# EAGLE design Diversity1.0 (EAGLE 5.11)
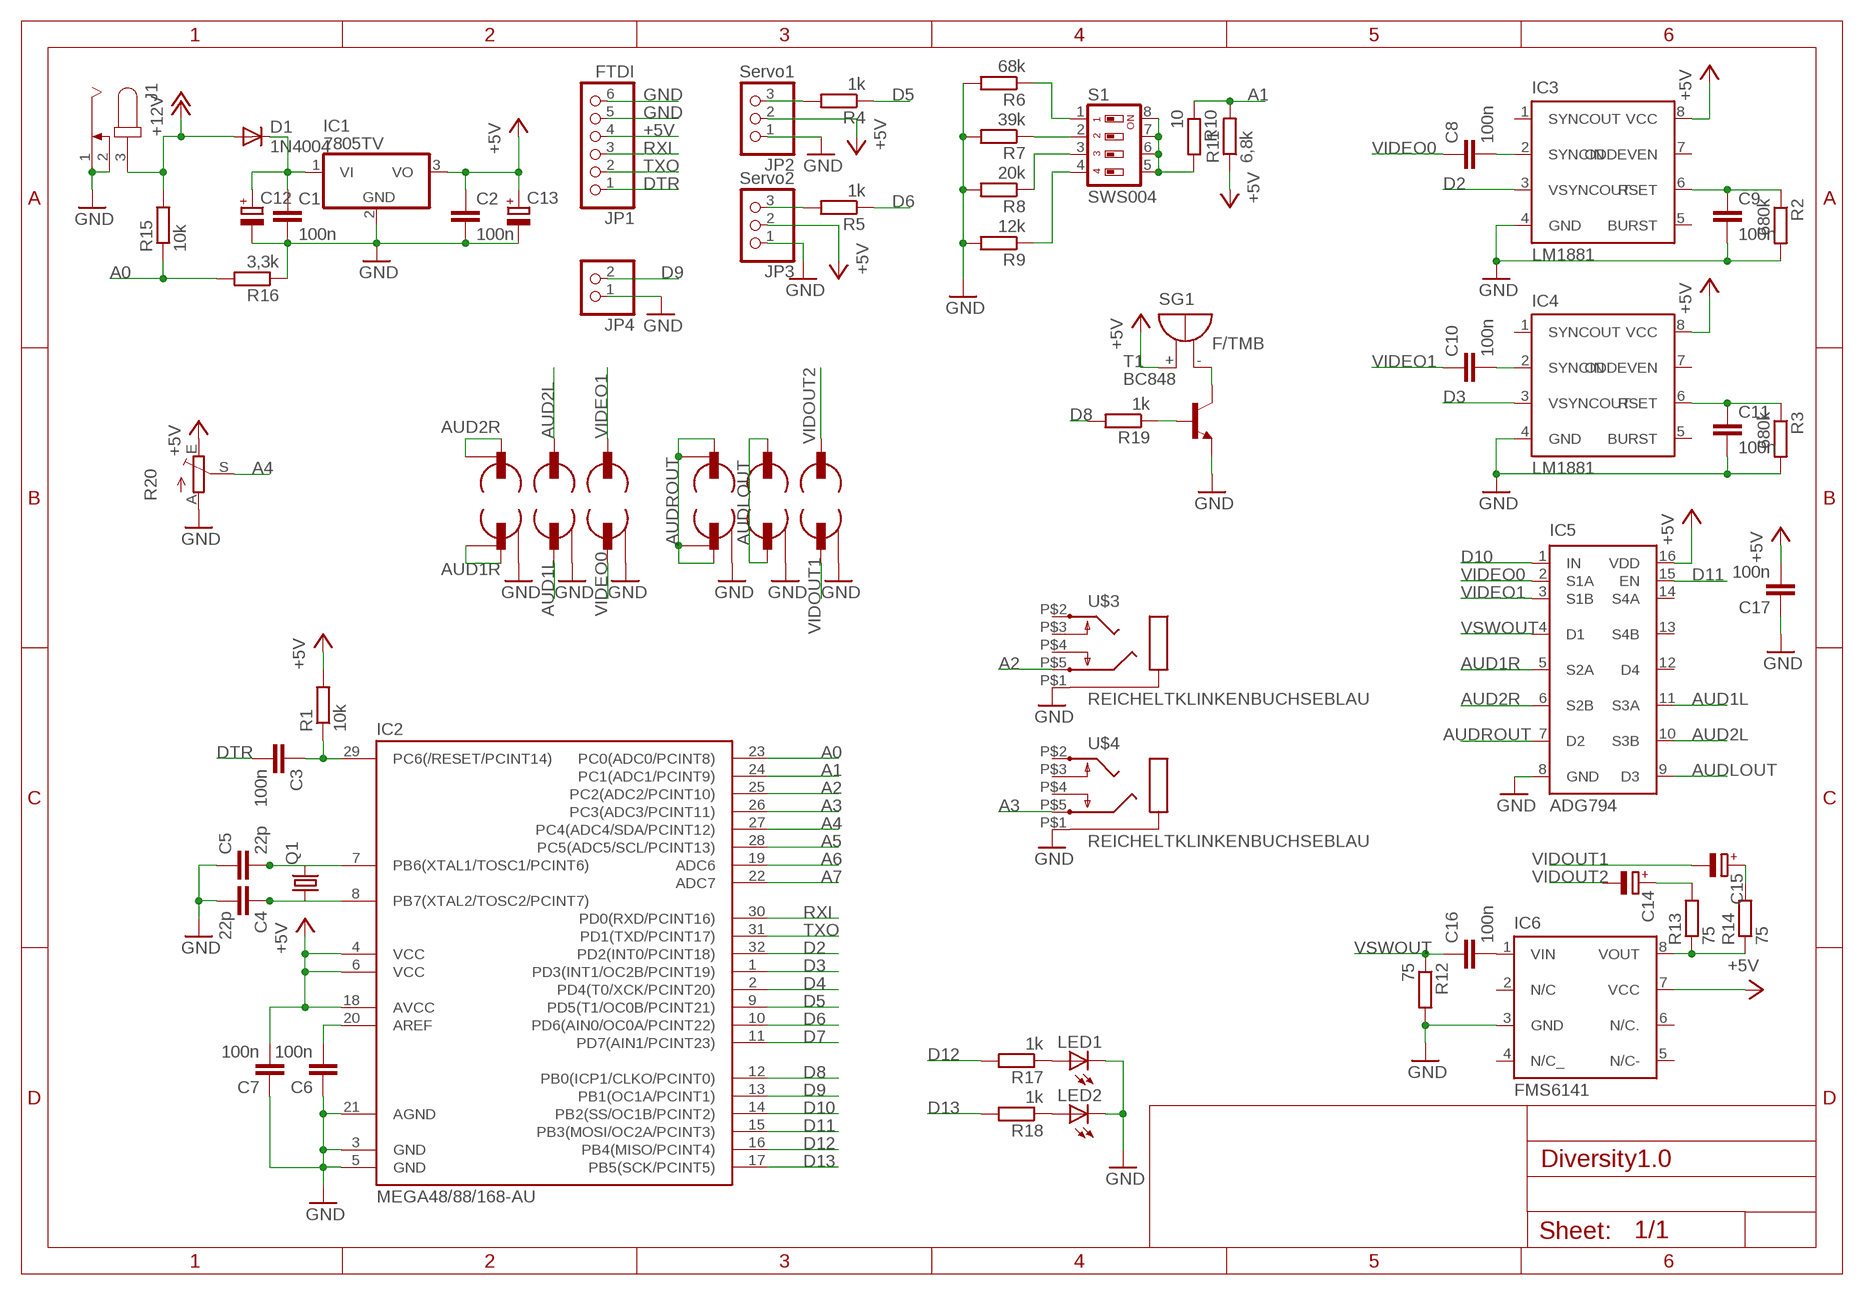
[diagram p0: schematic, sheet 1]

## Parts
C1  100n  C-EUC0805  [C0805]
C2  100n  C-EUC0805  [C0805]
C3  100n  C-EUC0805  [C0805]
C4  22p  C-EUC0805  [C0805]
C5  22p  C-EUC0805  [C0805]
C6  100n  C-EUC0805  [C0805]
C7  100n  C-EUC0805  [C0805]
C8  100n  C-EUC0805  [C0805]
C9  100n  C-EUC0805  [C0805]
C10  100n  C-EUC0805  [C0805]
C11  100n  C-EUC0805  [C0805]
C12  CPOL-EUE3.5-8  [E3,5-8]
C13  CPOL-EUE2.5-5  [E2,5-5]
C14  CPOL-EUE2.5-6  [E2,5-6]
C15  CPOL-EUE2.5-6  [E2,5-6]
C16  100n  C-EUC0805  [C0805]
C17  100n  C-EUC0805  [C0805]
D1  1N4004  [DO41-10]
IC1  7805TV  [TO220V]
IC2  MEGA48/88/168-AU  [TQFP32-08]
IC3  LM1881  [DIL08]
IC4  LM1881  [DIL08]
IC5  ADG794  [QSOP16]
IC6  FMS6141  [SO8]
J1  JACK-PLUG0  [SPC4077]
JP1  FTDI  PINHD-1X6  [1X06]
JP2  Servo1  PINHD-1X3  [1X03]
JP3  Servo2  PINHD-1X3  [1X03]
JP4  PINHD-1X2  [1X02]
LED1  LEDCHIP-LED0805  [CHIP-LED0805]
LED2  LEDCHIP-LED0805  [CHIP-LED0805]
Q1  CRYSTALSM49  [SM49]
R1  10k  R-EU_R0805  [R0805]
R2  680k  R-EU_R0805  [R0805]
R3  680k  R-EU_R0805  [R0805]
R4  1k  R-EU_R0805  [R0805]
R5  1k  R-EU_R0805  [R0805]
R6  68k  R-EU_R0805  [R0805]
R7  39k  R-EU_R0805  [R0805]
R8  20k  R-EU_R0805  [R0805]
R9  12k  R-EU_R0805  [R0805]
R10  10  R-EU_R0805  [R0805]
R11  6,8k  R-EU_R0805  [R0805]
R12  75  R-EU_R0805  [R0805]
R13  75  R-EU_R0805  [R0805]
R14  75  R-EU_R0805  [R0805]
R15  10k  R-EU_R0805  [R0805]
R16  3,3k  R-EU_R0805  [R0805]
R17  1k  R-EU_R0805  [R0805]
R18  1k  R-EU_R0805  [R0805]
R19  1k  R-EU_R0805  [R0805]
R20  TRIM_EU-PT10  [PT-10]
S1  SWS004  [SMS-004]
SG1  F/TMB  [F/TMB]
T1  BC848  [SOT23]
U$3  REICHELTKLINKENBUCHSEBLAU  [PG203J]
U$4  REICHELTKLINKENBUCHSEBLAU  [PG203J]
U$5  POLLINCINCHBUCHSE  [POLLIN6FACHCINCH]
U$6  POLLINCINCHBUCHSE  [POLLIN6FACHCINCH]

## Nets
+5V: C2.1 C7.2 C13.+ C17.2 IC1.3(VO) IC2.4(VCC) IC2.6(VCC) IC2.18(AVCC) IC3.8(VCC) IC4.8(VCC) IC5.16(VDD) IC6.7(VCC) JP1.4 JP2.2 JP3.2 R1.2 R11.1 R20.E SG1.+
+12V: D1.A J1.3 R15.2
A0: IC2.23(PC0(ADC0/PCINT8)) R15.1 R16.2
A1: IC2.24(PC1(ADC1/PCINT9)) R10.1 R11.2
A2: IC2.25(PC2(ADC2/PCINT10)) U$3.P$5
A3: IC2.26(PC3(ADC3/PCINT11)) U$4.P$5
A4: IC2.27(PC4(ADC4/SDA/PCINT12)) R20.S
A5: IC2.28(PC5(ADC5/SCL/PCINT13))
A6: IC2.19(ADC6)
A7: IC2.22(ADC7)
AUD1L: IC5.11(S3A) U$6.AUDIOLUNTEN(AUDLUNTEN)
AUD1R: IC5.5(S2A) U$6.AUDIORUNTEN1(AUDRUNTEN1) U$6.AUDIORUNTEN2(AUDRUNTEN2)
AUD2L: IC5.10(S3B) U$6.AUDIOLOBEN(AUDLOBEN)
AUD2R: IC5.6(S2B) U$6.AUDIOROBEN1(AUDROBEN1) U$6.AUDIOROBEN2(AUDROBEN2)
AUDLOUT: IC5.9(D3) U$5.AUDIOLOBEN(AUDLOBEN) U$5.AUDIOLUNTEN(AUDLUNTEN)
AUDROUT: IC5.7(D2) U$5.AUDIOROBEN1(AUDROBEN1) U$5.AUDIOROBEN2(AUDROBEN2) U$5.AUDIORUNTEN1(AUDRUNTEN1) U$5.AUDIORUNTEN2(AUDRUNTEN2)
D2: IC2.32(PD2(INT0/PCINT18)) IC3.3(VSYNCOUT)
D3: IC2.1(PD3(INT1/OC2B/PCINT19)) IC4.3(VSYNCOUT)
D4: IC2.2(PD4(T0/XCK/PCINT20))
D5: IC2.9(PD5(T1/OC0B/PCINT21)) R4.1
D6: IC2.10(PD6(AIN0/OC0A/PCINT22)) R5.1
D7: IC2.11(PD7(AIN1/PCINT23))
D8: IC2.12(PB0(ICP1/CLKO/PCINT0)) R19.2
D9: IC2.13(PB1(OC1A/PCINT1)) JP4.2
D10: IC2.14(PB2(SS/OC1B/PCINT2)) IC5.1(IN)
D11: IC2.15(PB3(MOSI/OC2A/PCINT3)) IC5.15(EN)
D12: IC2.16(PB4(MISO/PCINT4)) R17.2
D13: IC2.17(PB5(SCK/PCINT5)) R18.2
DTR: C3.2 JP1.1
GND: C1.2 C2.2 C4.2 C5.1 C6.1 C7.1 C9.2 C11.2 C12.- C13.- C17.1 IC1.2(GND) IC2.3(GND) IC2.5(GND) IC2.21(AGND) IC3.4(GND) IC4.4(GND) IC5.8(GND) IC6.3(GND) J1.1 J1.2 JP1.5 JP1.6 JP2.1 JP3.1 JP4.1 LED1.C LED2.C R2.2 R3.2 R6.2 R7.2 R8.2 R9.2 R12.2 R16.1 R20.A T1.2(E) U$3.P$1 U$4.P$1 U$5.GND1(G1) U$5.GND2(G2) U$5.GND3(G3) U$6.GND1(G1) U$6.GND2(G2) U$6.GND3(G3)
N$1: C5.2 IC2.7(PB6(XTAL1/TOSC1/PCINT6)) Q1.2
N$2: C4.1 IC2.8(PB7(XTAL2/TOSC2/PCINT7)) Q1.1
N$3: C3.1 IC2.29(PC6(/RESET/PCINT14)) R1.1
N$4: C6.2 IC2.20(AREF)
N$5: C16.2 IC6.1(VIN)
N$6: LED1.A R17.1
N$7: LED2.A R18.1
N$8: C1.1 C12.+ D1.C IC1.1(VI)
N$9: R6.1 S1.1
N$10: C15.+ R14.2
N$11: C14.+ R13.2
N$12: R7.1 S1.2
N$13: R8.1 S1.3
N$14: SG1.- T1.3(C)
N$15: R19.1 T1.1(B)
N$16: R9.1 S1.4
N$27: C8.2 IC3.2(SYNCIN)
N$28: C9.1 IC3.6(RSET) R2.1
N$29: JP2.3 R4.2
N$30: C10.2 IC4.2(SYNCIN)
N$31: C11.1 IC4.6(RSET) R3.1
N$32: JP3.3 R5.2
N$37: IC6.8(VOUT) R13.1 R14.1
N$39: R10.2 S1.5 S1.6 S1.7 S1.8
RXI: IC2.30(PD0(RXD/PCINT16)) JP1.3
TXO: IC2.31(PD1(TXD/PCINT17)) JP1.2
VIDEO0: C8.1 IC5.2(S1A) U$6.VIDEOUNTEN
VIDEO1: C10.1 IC5.3(S1B) U$6.VIDEOOBEN
VIDOUT1: C15.- U$5.VIDEOUNTEN
VIDOUT2: C14.- U$5.VIDEOOBEN
VSWOUT: C16.1 IC5.4(D1) R12.1
Unconnected: IC3.1(SYNCOUT) IC3.5(BURST) IC3.7(ODDEVEN) IC4.1(SYNCOUT) IC4.5(BURST) IC4.7(ODDEVEN) IC5.12(D4) IC5.13(S4B) IC5.14(S4A) IC6.2(N/C) IC6.5(N/C-) IC6.6(N/C.) U$3.P$2 U$3.P$3 U$3.P$4 U$4.P$2 U$4.P$3 U$4.P$4

## Power pins joined to a net without a drawn wire
N/C_: IC6.4(N/C_)

## Library data of the parts
C1-C11 C16 C17 = rcl:C-EU: CAPACITOR, European symbol
C12-C15 = rcl:CPOL-EU: POLARIZED CAPACITOR, European symbol
D1 = diode:1N4004: DIODE general purpose rectifier, 1 A
IC1 = linear:78*: Positive VOLTAGE REGULATOR Source: http://cache.national.com/ds/LM/LM78L05.pdf http://www.fairchildsemi.com/ds/LM/LM7805.pdf
IC2 = avr-4:MEGA48/88/168
IC3 IC4 = lm1881:LM1881
IC5 = 001eigene:ADG794
IC6 = 001eigene:FMS6141
J1 = con-jack:JACK-PLUG: DC POWER JACK Power Jack, DC, Right Angle, Through Hole, Rated 5A at 16VDC, PC Terminals Distributor: Farnell (www.Farnell.de) Drawing: 84N1161.pdf / 84N1162.pdf Manufacturer: SPC Technology (www.spctechnology.com) Type: SPC4077 / SPC 4078; OC_FARNELL: unknown; OC_NEWARK: unknown
JP1 = pinhead:PINHD-1X6: PIN HEADER
JP2 JP3 = pinhead:PINHD-1X3: PIN HEADER
JP4 = pinhead:PINHD-1X2: PIN HEADER
LED1 LED2 = led:LED: LED OSRAM: - CHIPLED LG R971, LG N971, LY N971, LG Q971, LY Q971, LO R971, LY R971 LH N974, LH R974 LS Q976, LO Q976, LY Q976 LO Q996 - Hyper CHIPLED LW Q18S LB Q993, LB Q99A, LB R99A - SideLED LS A670, LO A670, LY A670, LG A670, LP A670 LB A673, LV A673, LT A673, LW A673 LH A674 LY A675 LS A676, LA A676, LO A676, LY A676, LW A676 LS A679, LY A679, LG A679 - Hyper Micro SIDELED® LS Y876, LA Y876, LO Y876, LY Y876 LT Y87S - SmartLED LW L88C, LW L88S LB L89C, LB L89S, LG L890 LS L89K, LO L89K, LY L89K LS L896, LA L896, LO L896, LY L896 - TOPLED LS T670, LO T670, LY T670, LG T670, LP T670 LSG T670, LSP T670, LSY T670, LOP T670, LYG T670 LG T671, LOG T671, LSG T671 LB T673, LV T673, LT T673, LW T673 LH T674 LS T676, LA T676, LO T676, LY T676, LB T676, LH T676, LSB T676, LW T676 LB T67C, LV T67C, LT T67C, LS T67K, LO T67K, LY T67K, LW E67C LS E67B, LA E67B, LO E67B, LY E67B, LB E67C, LV E67C, LT E67C LW T67C LS T679, LY T679, LG T679 LS T770, LO T770, LY T770, LG T770, LP T770 LB T773, LV T773, LT T773, LW T773 LH T774 LS E675, LA E675, LY E675, LS T675 LS T776, LA T776, LO T776, LY T776, LB T776 LHGB T686 LT T68C, LB T68C - Hyper Mini TOPLED® LB M676 - Mini TOPLED Santana® LG M470 LS M47K, LO M47K, LY M47K Source: http://www.osram.convergy.de LUXEON: - LUMILED® LXK2-PW12-R00, LXK2-PW12-S00, LXK2-PW14-U00, LXK2-PW14-V00 LXK2-PM12-R00, LXK2-PM12-S00, LXK2-PM14-U00 LXK2-PE12-Q00, LXK2-PE12-R00, LXK2-PE12-S00, LXK2-PE14-T00, LXK2-PE14-U00 LXK2-PB12-K00, LXK2-PB12-L00, LXK2-PB12-M00, LXK2-PB14-N00, LXK2-PB14-P00, LXK2-PB14-Q00 LXK2-PR12-L00, LXK2-PR12-M00, LXK2-PR14-Q00, LXK2-PR14-R00 LXK2-PD12-Q00, LXK2-PD12-R00, LXK2-PD12-S00 LXK2-PH12-R00, LXK2-PH12-S00 LXK2-PL12-P00, LXK2-PL12-Q00, LXK2-PL12-R00 Source: www.luxeon.com KINGBRIGHT: KA-3528ASYC Source: www.kingbright.com
Q1 = crystal:CRYSTAL: CRYSTAL; OC_FARNELL: unknown; OC_NEWARK: unknown
R1-R19 = rcl:R-EU_: RESISTOR, European symbol
R20 = pot:TRIM_EU-: POTENTIOMETER
S1 = smd-special:SWS004: SMD Dip Switch 4 pol.
SG1 = buzzer:F/TMB: BUZZER Source: Buerklin; OC_FARNELL: unknown; OC_NEWARK: unknown
T1 = transistor:BC848: NPN TRANSISTOR
U$3 U$4 = 001klinke:REICHELTKLINKENBUCHSEBLAU
U$5 U$6 = pollin:POLLINCINCHBUCHSE

## Board
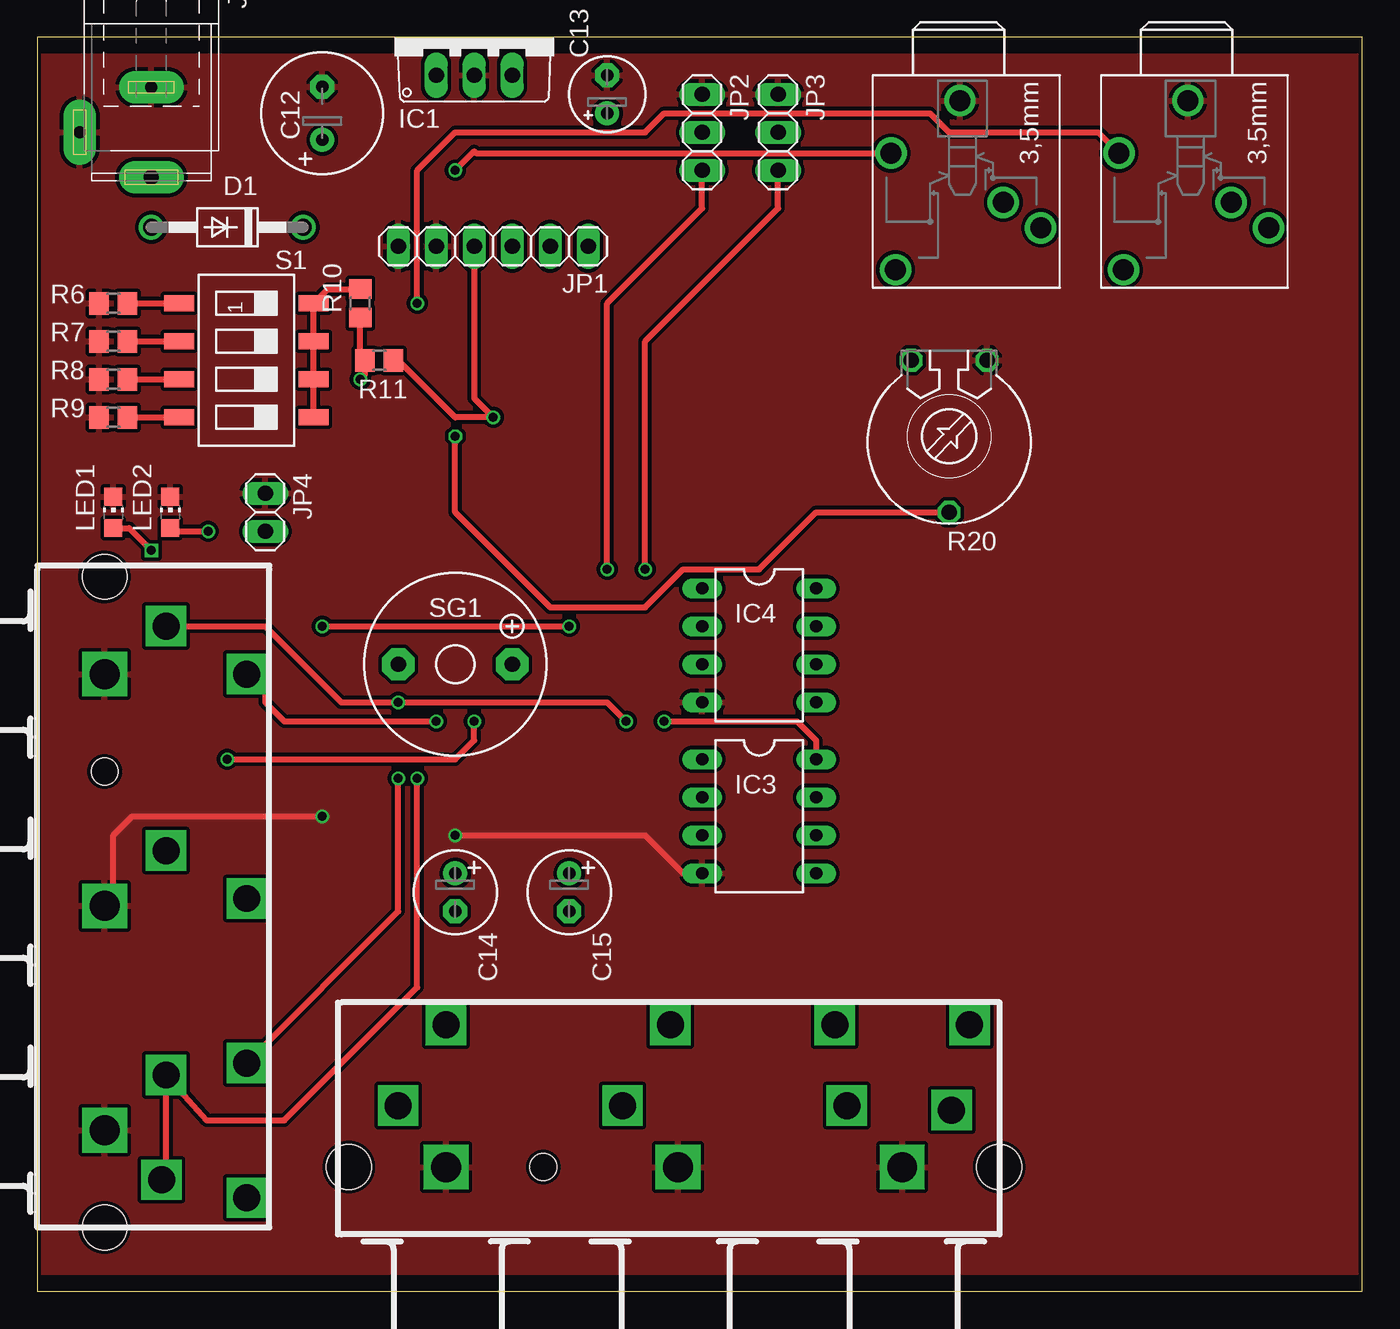
[diagram p1: board, top side]
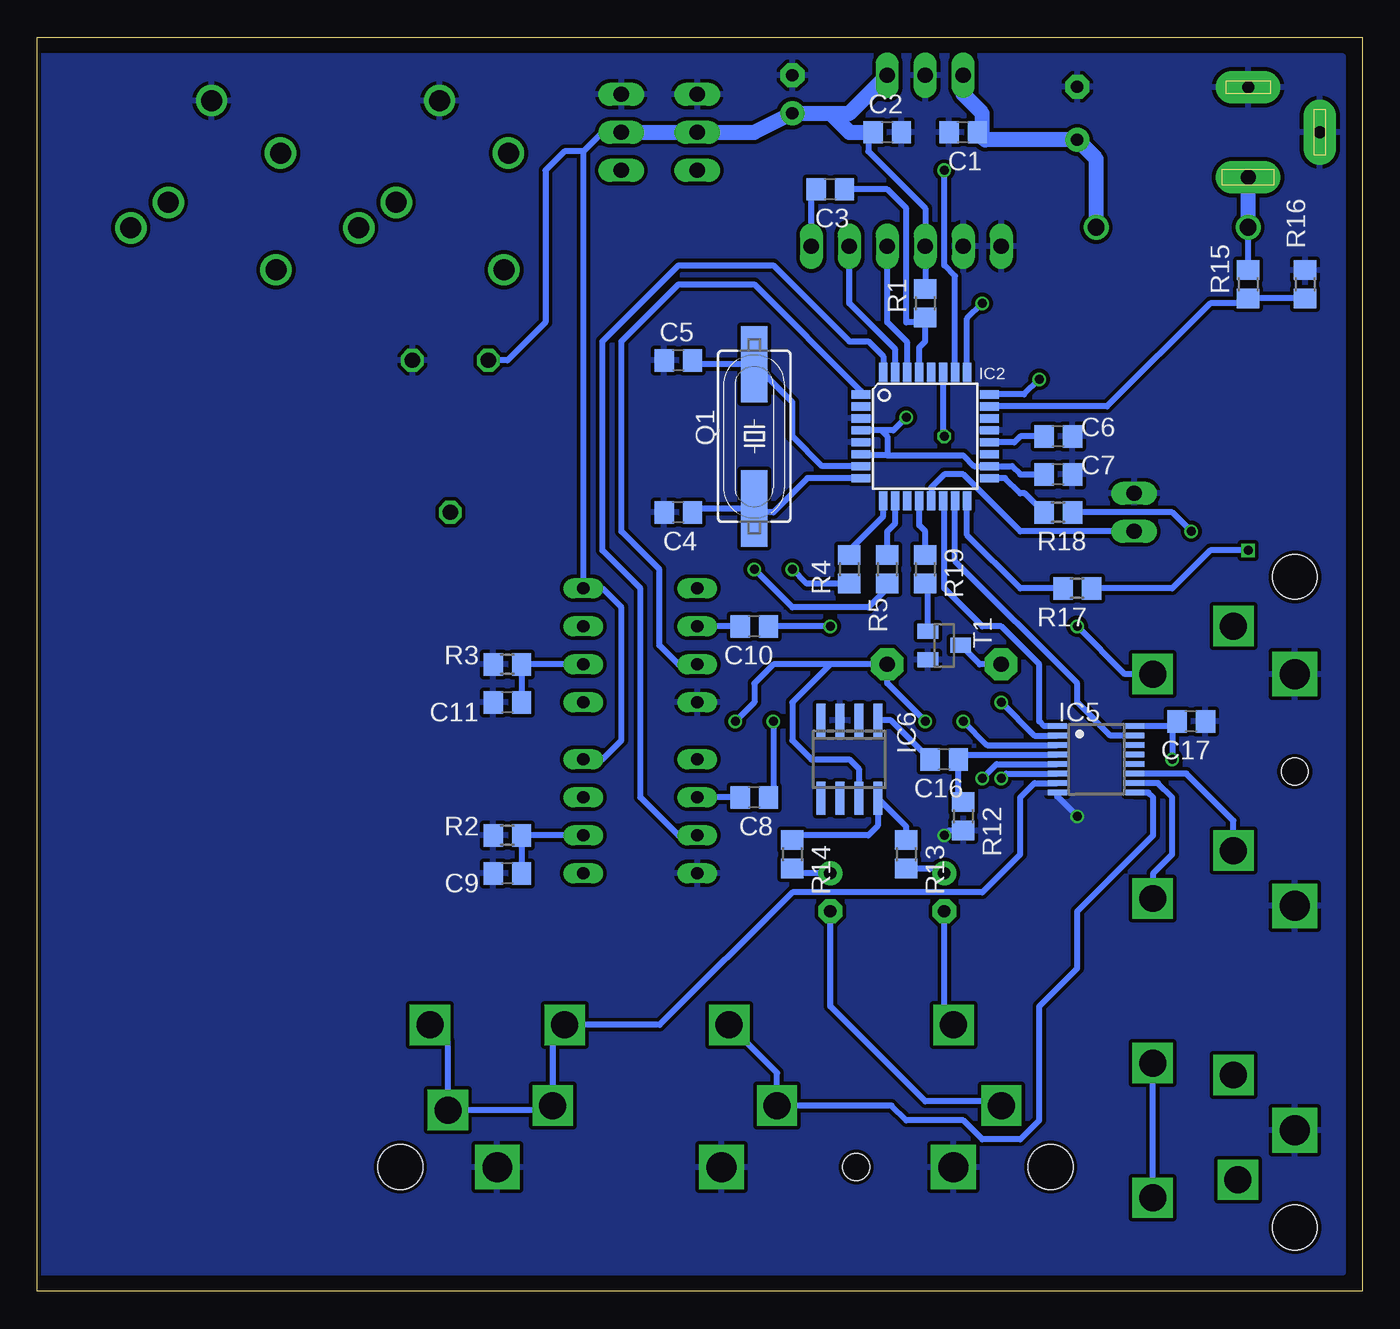
[diagram p2: board, bottom side, seen from below]

Size 88.57 x 83.81 mm. Coordinates in mm from the lower left corner, seen from the top.
Outline: 0,0 88.57,0 88.57,83.81 0,83.81 0,0
Copper layers (1*16): Top 0.035mm / dielectric 1.5mm / Bottom 0.035mm
Design rules "ITead_rule": minimum track width 6mil, minimum drill 12mil, track to track 6mil, track to pad 6mil, pad to pad 6mil, via to via 6mil, smd to smd 0mil, copper to edge 10mil, drill to drill 10mil, minimum pad ring 10mil, minimum via ring 6mil, stop-mask expansion 2mil, vias tented up to drill 100mil, thermal gap 10mil

### Footprints (pad centres in the part's own frame; a part is rotated, then mirrored left to right if it is on the bottom)
C0805 = smd 1.3 x 1.5: 1 -0.95,0; 2 0.95,0
E3,5-8 = drill 0.813 pad 1.6 round: + -1.778,0 | drill 0.813 pad 1.6 octagon: - 1.778,0
E2,5-5 = drill 0.813 pad 1.6 round: + -1.27,0 | drill 0.813 pad 1.6 octagon: - 1.27,0
E2,5-6 = drill 0.813 pad 1.6 round: + -1.27,0 | drill 0.813 pad 1.6 octagon: - 1.27,0
DO41-10 = drill 1.118 round: A 5.08,0; C -5.08,0
TO220V = drill 1.016 long: 1 -2.54,-2.54; 2 0,-2.54; 3 2.54,-2.54
TQFP32-08 = smd 1.27 x 0.559: 1 -4.293,2.8; 2 -4.293,2; 3 -4.293,1.2; 4 -4.293,0.4; 5 -4.293,-0.4; 6 -4.293,-1.2; 7 -4.293,-2; 8 -4.293,-2.8; 17 4.293,-2.8; 18 4.293,-2; 19 4.293,-1.2; 20 4.293,-0.4; 21 4.293,0.4; 22 4.293,1.2; 23 4.293,2; 24 4.293,2.8 | smd 0.559 x 1.27: 9 -2.8,-4.293; 10 -2,-4.293; 11 -1.2,-4.293; 12 -0.4,-4.293; 13 0.4,-4.293; 14 1.2,-4.293; 15 2,-4.293; 16 2.8,-4.293; 25 2.8,4.293; 26 2,4.293; 27 1.2,4.293; 28 0.4,4.293; 29 -0.4,4.293; 30 -1.2,4.293; 31 -2,4.293; 32 -2.8,4.293
DIL08 = drill 0.813 long: 1 -3.81,-3.81; 2 -1.27,-3.81; 3 1.27,-3.81; 4 3.81,-3.81; 5 3.81,3.81; 6 1.27,3.81; 7 -1.27,3.81; 8 -3.81,3.81
QSOP16 = smd 0.381 x 1.27: 1 0.318,-0.06; 2 0.953,-0.06; 3 1.587,-0.06; 4 2.223,-0.06; 5 2.857,-0.06; 6 3.493,-0.06; 7 4.128,-0.06; 8 4.763,-0.06; 9 4.763,5.14; 10 4.128,5.14; 11 3.493,5.14; 12 2.857,5.14; 13 2.223,5.14; 14 1.587,5.14; 15 0.953,5.14; 16 0.318,5.14
SO8 = smd 0.6 x 2.2: 1 0.635,-0.06; 2 1.905,-0.06; 3 3.175,-0.06; 4 4.445,-0.06; 5 4.445,5.14; 6 3.175,5.14; 7 1.905,5.14; 8 0.635,5.14
SPC4077 = drill 0.8 pad 2.184 long: 1 -3,0; 2 0,-4.8 | drill 1 pad 2.184 long: 3 3,0
1X06 = drill 1.016 long: 1 -6.35,0; 2 -3.81,0; 3 -1.27,0; 4 1.27,0; 5 3.81,0; 6 6.35,0
1X03 = drill 1.016 long: 1 -2.54,0; 2 0,0; 3 2.54,0
1X02 = drill 1.016 long: 1 -1.27,0; 2 1.27,0
CHIP-LED0805 = smd 1.2 x 1.2: A 0,-1.05; C 0,1.05
SM49 = smd 5.08 x 1.778: 1 -4.826,0; 2 4.826,0
R0805 = smd 1.3 x 1.5: 1 -0.95,0; 2 0.95,0
PT-10 = drill 1.016 octagon: A -2.54,-5.08; E 2.54,-5.08; S 0,5.08
SMS-004 = smd 1.092 x 2.007: 1 -3.81,-4.496; 2 -1.27,-4.496; 3 1.27,-4.496; 4 3.81,-4.496; 5 3.81,4.496; 6 1.27,4.496; 7 -1.27,4.496; 8 -3.81,4.496
F/TMB = drill 1.016 pad 2.159 octagon: + 3.81,0; - -3.81,0
SOT23 = smd 1 x 1.4: 1 -0.95,-1.1; 2 0.95,-1.1; 3 0,1.1
PG203J = drill 1.4 round: P$1 1.7,5.8; P$2 10.2,11.2; P$3 8.5,8.7; P$4 13,1.5; P$5 5.2,1.2
POLLIN6FACHCINCH = drill 1.8 square: AUDIOLOBEN -14,22; AUDIOLUNTEN -8.6,18.8; AUDIOROBEN1 -14,42; AUDIOROBEN2 -14,33; AUDIORUNTEN1 -8.3,40.8; AUDIORUNTEN2 -8.6,33.8; VIDEOOBEN -14,7; VIDEOUNTEN -8.6,3.8 | drill 2 square: GND1 -4.5,37.5; GND2 -4.5,22.5; GND3 -4.5,7 | hole 1.8: -4.5,13.5 | hole 3: -4.5,0.5; -4.5,43.98

### Placement (x,y rotation side)
C1  26.67,77.47 180 bottom
C2  31.75,77.47 0 bottom
C3  35.56,73.66 180 bottom
C4  45.72,52.07 180 bottom
C5  45.72,62.23 0 bottom
C6  20.32,57.15 180 bottom
C7  20.32,54.61 180 bottom
C8  40.64,33.02 180 bottom
C9  57.15,27.94 180 bottom
C10  40.64,44.45 180 bottom
C11  57.15,39.37 180 bottom
C12  19.05,78.74 90 top
C13  38.1,80.01 90 top
C14  27.94,26.67 270 top
C15  35.56,26.67 270 top
C16  27.94,35.56 180 bottom
C17  11.43,38.1 180 bottom
D1  12.7,71.12 180 top
IC1  29.21,83.82 0 top
IC2  29.21,57.15 0 bottom
IC3  48.26,31.75 270 top
IC4  48.26,43.18 270 top
IC5  20.32,38.1 270 bottom
IC6  31.75,38.1 180 bottom
J1  7.62,77.47 270 top
JP1  30.48,69.85 180 top
JP2  44.45,77.47 270 top
JP3  49.53,77.47 270 top
JP4  15.24,52.07 270 top
LED1  5.08,52.07 0 top
LED2  8.89,52.07 0 top
Q1  40.64,57.15 90 bottom
R1  29.21,66.04 90 bottom
R2  57.15,30.48 180 bottom
R3  57.15,41.91 180 bottom
R4  34.29,48.26 270 bottom
R5  31.75,48.26 270 bottom
R6  5.08,66.04 180 top
R7  5.08,63.5 180 top
R8  5.08,60.96 180 top
R9  5.08,58.42 180 top
R10  21.59,66.04 90 top
R11  22.86,62.23 180 top
R12  26.67,31.75 270 bottom
R13  30.48,29.21 270 bottom
R14  38.1,29.21 270 bottom
R15  7.62,67.31 90 bottom
R16  3.81,67.31 270 bottom
R17  19.05,46.99 180 bottom
R18  20.32,52.07 180 bottom
R19  29.21,48.26 90 bottom
R20  60.96,57.15 180 top
S1  13.97,62.23 270 top
SG1  27.94,41.91 0 top
T1  27.94,43.18 270 bottom
U$3  71.12,81.28 270 top
U$4  55.88,81.28 270 top
U$5  20.32,3.81 270 top
U$6  0,48.26 180 top

### Tracks (layer width: path | path; a pad name or v marks a point on that pad's centre or on a via)
+5V  (via drill 0.6)
  Top 0.406: v29.21,38.1 29.21,36.83 27.94,35.56 v12.7,35.56 | v41.91,38.1 50.8,38.1 52.07,36.83 IC3.8 | JP1.4 29.21,59.69 v30.48,58.42 27.94,58.42 24.13,62.23 R11.1
  Bottom 0.406: R1.2 JP1.4 29.21,72.39 33.02,76.2 33.02,77.15 C2.1 | C7.2 22.86,54.61 23.4,55.15 IC2.18 25.94,55.15 26.67,55.88 31.75,55.88 | IC5.16 12.7,37.78 C17.2 12.7,37.78 v12.7,35.56 | IC6.7 33.66,34.92 34.29,35.56 36.83,35.56 38.1,36.83 38.1,39.37 35.56,41.91 SG1.+ | IC3.8 50.8,35.56 49.53,36.83 49.53,45.72 50.8,46.99 IC4.8 52.07,76.2 | 52.07,76.2 50.8,77.47 JP3.2 | SG1.+ 39.37,41.91 40.64,40.64 40.64,39.37 v41.91,38.1 | SG1.+ 31.75,40.64 v29.21,38.1 | 31.75,55.88 33.43,55.88 IC2.6 | 32.15,57.55 IC2.4 | 32.15,57.55 31.75,57.15 31.75,55.88 | 32.15,57.55 31.35,57.55 v30.48,58.42 | 52.07,76.2 53.34,76.2 54.61,74.93 54.61,64.77 57.15,62.23 R20.E
  Bottom 1.016: JP3.2 JP2.2 40.64,77.47 C13.+ 35.56,78.74 | 35.56,78.74 34.29,78.74 IC1.3 | C2.1 34.29,77.47 35.56,78.74
+12V
  Bottom 0.406: R15.2 D1.A
  Bottom 1.016: D1.A J1.3
A0
  Bottom 0.406: R16.2 R15.1 7.94,66.04 10.16,66.04 17.05,59.15 IC2.23
A1  (via drill 0.6)
  Top 0.406: R10.1 21.59,62.55 R11.2 21.91,61.28 v21.59,60.96
  Bottom 0.406: IC2.24 22.6,59.95 v21.59,60.96
A2  (via drill 0.6)
  Top 0.406: v25.4,66.04 25.4,74.93 27.94,77.47 40.64,77.47 41.91,78.74 59.69,78.74 60.96,77.47 70.93,77.47 U$3.P$5
  Bottom 0.406: IC2.25 26.41,65.03 v25.4,66.04
A3  (via drill 0.6)
  Top 0.406: v27.94,74.93 29.21,76.2 29.33,76.08 U$4.P$5
  Bottom 0.406: IC2.26 27.21,67.85 27.94,68.58 v27.94,74.93
A4  (via drill 0.6)
  Top 0.406: R20.S 52.07,52.07 48.26,48.26 43.18,48.26 40.64,45.72 34.29,45.72 27.94,52.07 v27.94,57.15
  Bottom 0.406: IC2.27 28.01,57.22 v27.94,57.15
AUD1L
  Bottom 0.406: IC5.11 11.75,34.61 8.6,31.46 U$6.AUDIOLUNTEN
AUD1R  (via drill 0.6)
  Top 0.406: v25.4,34.29 25.4,20.32 16.51,11.43 11.33,11.43 U$6.AUDIORUNTEN2 8.6,7.76 U$6.AUDIORUNTEN1
  Bottom 0.406: IC5.5 24.45,35.24 v25.4,34.29
AUD2L
  Bottom 0.406: IC5.10 13.65,33.97 12.7,33.02 12.7,29.21 13.97,27.94 13.97,26.29 U$6.AUDIOLOBEN
AUD2R  (via drill 0.6)
  Top 0.406: v24.13,34.29 24.13,25.39 U$6.AUDIOROBEN2
  Bottom 0.406: IC5.6 23.81,34.61 v24.13,34.29 | U$6.AUDIOROBEN1 U$6.AUDIOROBEN2
AUDLOUT
  Bottom 0.406: IC5.9 14.29,33.34 13.97,33.02 13.97,30.48 19.05,25.4 19.05,21.59 21.59,19.05 21.59,11.43 22.86,10.16 25.4,10.16 26.67,11.43 30.48,11.43 31.46,12.41 U$5.AUDIOLUNTEN 39.12,14.61 U$5.AUDIOLOBEN
AUDROUT
  Bottom 0.406: U$5.AUDIOROBEN1 62.29,17.78 62.23,17.78 61.12,16.67 U$5.AUDIORUNTEN1 54.42,12.11 U$5.AUDIORUNTEN2 54.12,17.01 U$5.AUDIOROBEN2 46.96,17.81 38.1,26.67 25.4,26.67 22.86,29.21 22.86,33.02 21.91,33.97 IC5.7
D2
  Bottom 0.406: IC3.3 45.72,30.48 48.26,33.02 48.26,46.99 50.8,49.53 50.8,63.5 45.72,68.58 39.37,68.58 34.29,63.5 33.02,63.5 32.01,62.49 IC2.32
D3
  Bottom 0.406: IC4.3 45.72,41.91 46.99,43.18 46.99,48.26 49.53,50.8 49.53,63.5 45.72,67.31 40.64,67.31 33.5,60.17 IC2.1
D5
  Bottom 0.406: IC2.9 32.01,51.81 34.29,49.53 R4.1
D6
  Bottom 0.406: IC2.10 31.21,51.34 31.75,50.8 R5.1
D8
  Bottom 0.406: IC2.12 29.61,51.2 29.21,50.8 R19.2
D9
  Bottom 0.406: IC2.13 28.81,53.74 27.94,54.61 26.67,54.61 22.86,50.8 JP4.2
D10
  Bottom 0.406: IC5.1 21.27,37.78 21.59,38.1 21.59,41.91 24.13,44.45 25.4,44.45 27.94,46.99 27.94,52.79 IC2.14
D11
  Bottom 0.406: IC5.15 16.83,37.15 19.05,39.37 19.05,40.64 27.21,48.8 IC2.15
D12
  Bottom 0.406: IC2.16 26.41,50.54 22.86,46.99 R17.2
D13
  Bottom 0.406: IC2.17 23.87,54.35 22.86,53.34 22.54,53.34 R18.2
DTR
  Bottom 0.406: JP1.1 36.83,73.34 C3.2
GND  (via drill 0.6)
  Top 0.406: v27.94,30.48 40.64,30.48 43.18,27.94 IC3.4 | v19.05,31.75 6.35,31.75 5.08,30.48 5.08,26.34 U$6.GND2
  Bottom 0.406: R12.2 27.62,30.8 v27.94,30.48 | IC5.8 20.38,33.08 v19.05,31.75
  pour Bottom (isolate 0.254): 1.27,82.55 91.44,82.55 91.44,1.27 1.27,1.27
  pour Top (isolate 0.254): 0,82.55 90.17,82.55 90.17,1.27 0,1.27
N$1
  Bottom 0.406: IC2.7 36.1,55.15 38.1,57.15 38.1,59.44 Q1.2 44.52,61.98 C5.2
N$2
  Bottom 0.406: IC2.8 37.09,54.35 39.37,52.07 40.39,52.07 Q1.1 44.52,52.32 C4.1
N$3
  Bottom 0.406: IC2.29 29.61,63.1 29.21,63.5 R1.1 29.53,64.77 30.48,64.77 30.48,72.39 31.75,73.66 C3.1
N$4
  Bottom 0.406: IC2.20 23.26,56.75 22.86,57.15 C6.2
N$5
  Bottom 0.406: IC6.1 31.49,38.16 C16.2
N$6  (via drill 0.6)
  Top 0.406: LED1.A 6.13,51.02 v7.62,49.53
  Bottom 0.406: v7.62,49.53 10.16,49.53 12.7,46.99 R17.1
N$7  (via drill 0.6)
  Top 0.406: v11.43,50.8 9.11,50.8 LED2.A
  Bottom 0.406: R18.1 12.7,52.07 v11.43,50.8
N$8
  Bottom 0.406: C1.1 25.4,77.47
  Bottom 1.016: C1.1 25.21,76.96 C12.+ 17.78,75.69 D1.C | IC1.1 26.67,80.01 25.4,78.74 25.4,77.47
N$9
  Top 0.406: R6.1 S1.1
N$10
  Bottom 0.406: C15.+ 37.78,27.94 R14.2
N$11
  Bottom 0.406: R13.2 28.26,28.26 C14.+
N$12
  Top 0.406: R7.1 S1.2
N$13
  Top 0.406: R8.1 S1.3
N$14
  Bottom 0.406: SG1.- 25.57,41.91 T1.3
N$15
  Bottom 0.406: T1.1 29.04,47.14 R19.1
N$16
  Top 0.406: R9.1 S1.4
N$27
  Bottom 0.406: C8.2 IC3.2
N$28
  Bottom 0.406: IC3.6 R2.1 C9.1
N$29  (via drill 0.6)
  Top 0.406: v38.1,48.26 38.1,66.04 44.45,72.39 JP2.3
  Bottom 0.406: R4.2 37.15,47.31 v38.1,48.26
N$30
  Bottom 0.406: C10.2 IC4.2
N$31
  Bottom 0.406: IC4.6 R3.1 C11.1
N$32  (via drill 0.6)
  Top 0.406: v40.64,48.26 40.64,63.5 49.53,72.39 JP3.3
  Bottom 0.406: R5.2 31.75,46.99 33.02,45.72 38.1,45.72 v40.64,48.26
N$37
  Bottom 0.406: R13.1 30.48,31.05 IC6.8 32.38,31.11 33.02,30.48 37.78,30.48 R14.1
N$39
  Top 0.406: S1.5 S1.6 S1.7 S1.8 19.42,66.99 R10.2
RXI
  Bottom 0.406: IC2.30 30.41,63.43 31.75,64.77 JP1.3
TXO
  Bottom 0.406: IC2.31 31.21,62.96 34.29,66.04 JP1.2
VIDEO0  (via drill 0.6)
  Top 0.406: U$6.VIDEOUNTEN 8.31,44.45 15.24,44.45 20.32,39.37 v24.13,39.37 38.1,39.37 v39.37,38.1
  Bottom 0.406: IC5.2 21.91,37.15 v24.13,39.37 | v39.37,38.1 39.37,33.34 C8.1
VIDEO1  (via drill 0.6)
  Top 0.406: v26.67,38.1 16.51,38.1 15.24,39.37 15.24,40.02 U$6.VIDEOOBEN | v19.05,44.45 v35.56,44.45
  Bottom 0.406: IC5.3 25.08,36.51 v26.67,38.1 | U$6.VIDEOOBEN 15.86,41.26 v19.05,44.45 | v35.56,44.45 C10.1
VIDOUT1
  Bottom 0.406: C15.- 35.56,19.05 29.21,12.7 24.41,12.7 U$5.VIDEOUNTEN
VIDOUT2
  Bottom 0.406: C14.- 27.94,18.43 U$5.VIDEOOBEN
VSWOUT
  Bottom 0.406: IC5.4 26.67,35.88 C16.1 26.99,33.02 R12.1